# EasyEDA Pro project 21届智能车+蚂蚁搬家+主驱一体PCB文件.epro, schematic Schematic1

## Sheets
1 电源: Board Name: V1.0（20251113）; Create Date: 2025-11-10; Page Name: 电源; Project Name: NXP_micropython主板20251110; Schematic Name: Schematic1; Update Date: 2025-11-19; BladeWidth: 10; Company: 嘉立创EDA; Page Size: A4; RegionStart: 1; ShowBorder: 1; TitleBlock: 1; TitleBlockPosition: 3; Version: V1.0; XRegionCount: 6; YRegionCount: 4
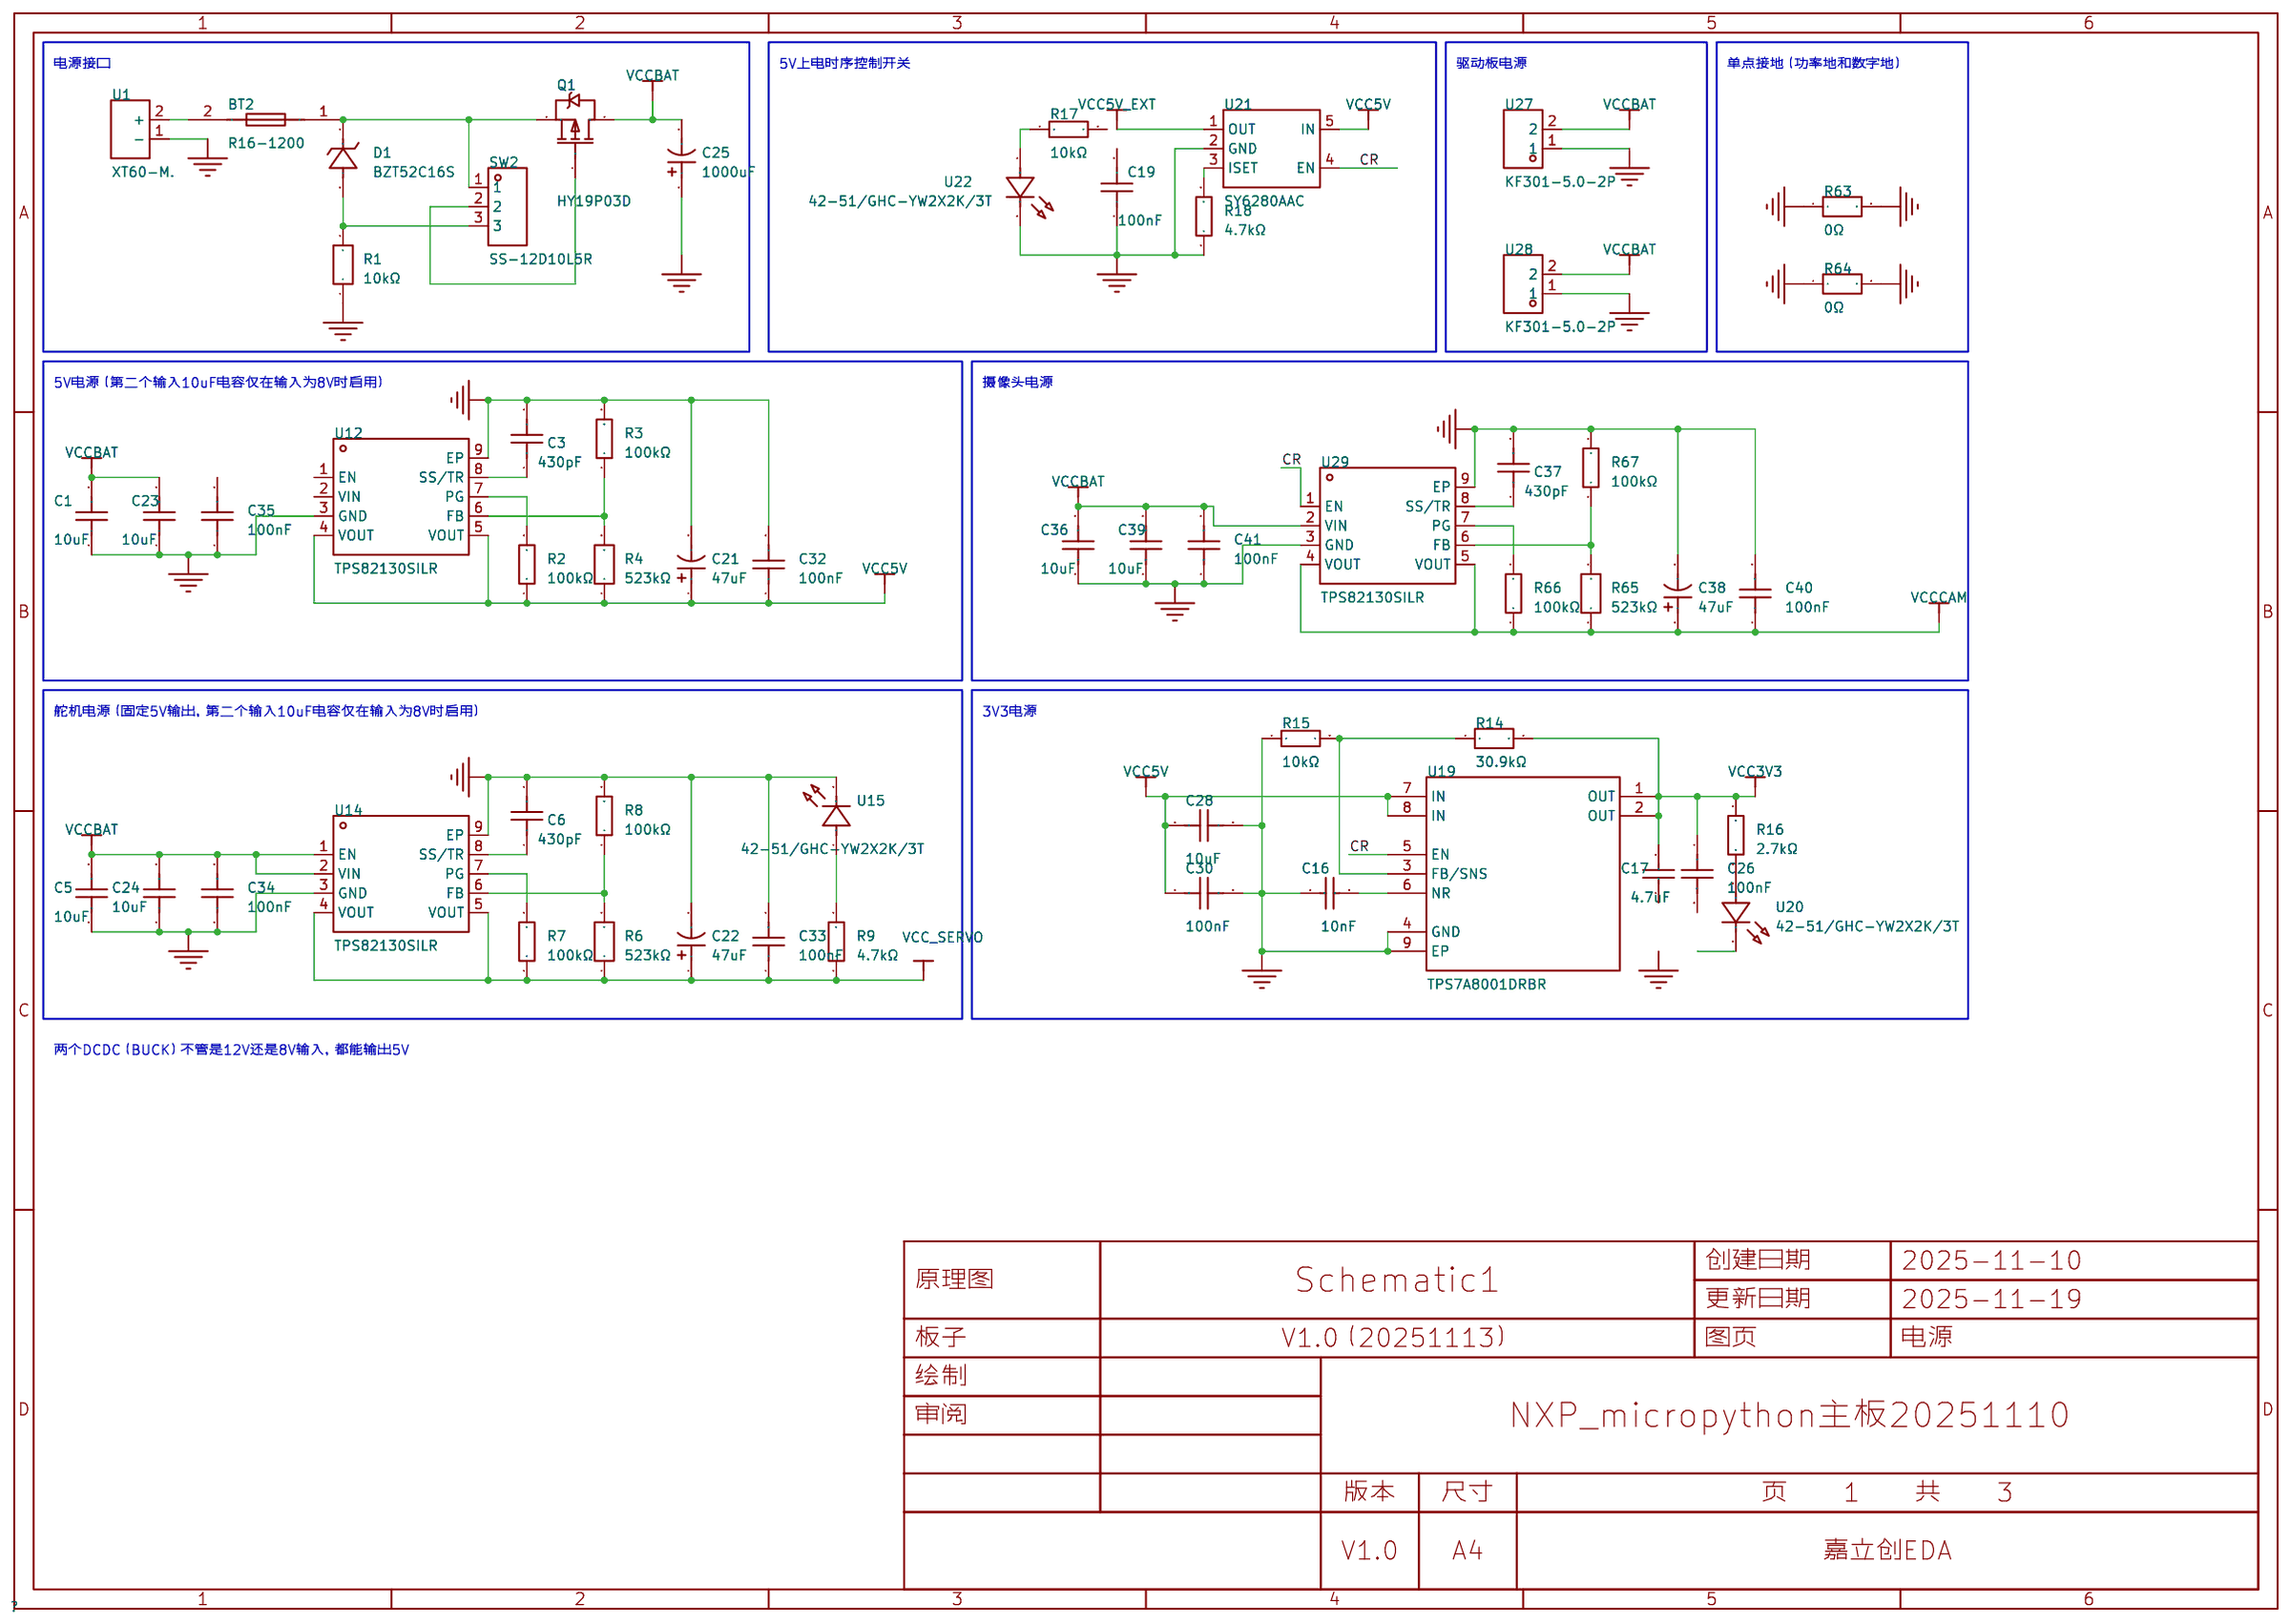
[diagram p0: 电源]
2 外设: Board Name: 20251113; Page Name: 外设; Update Date: 2025-11-15
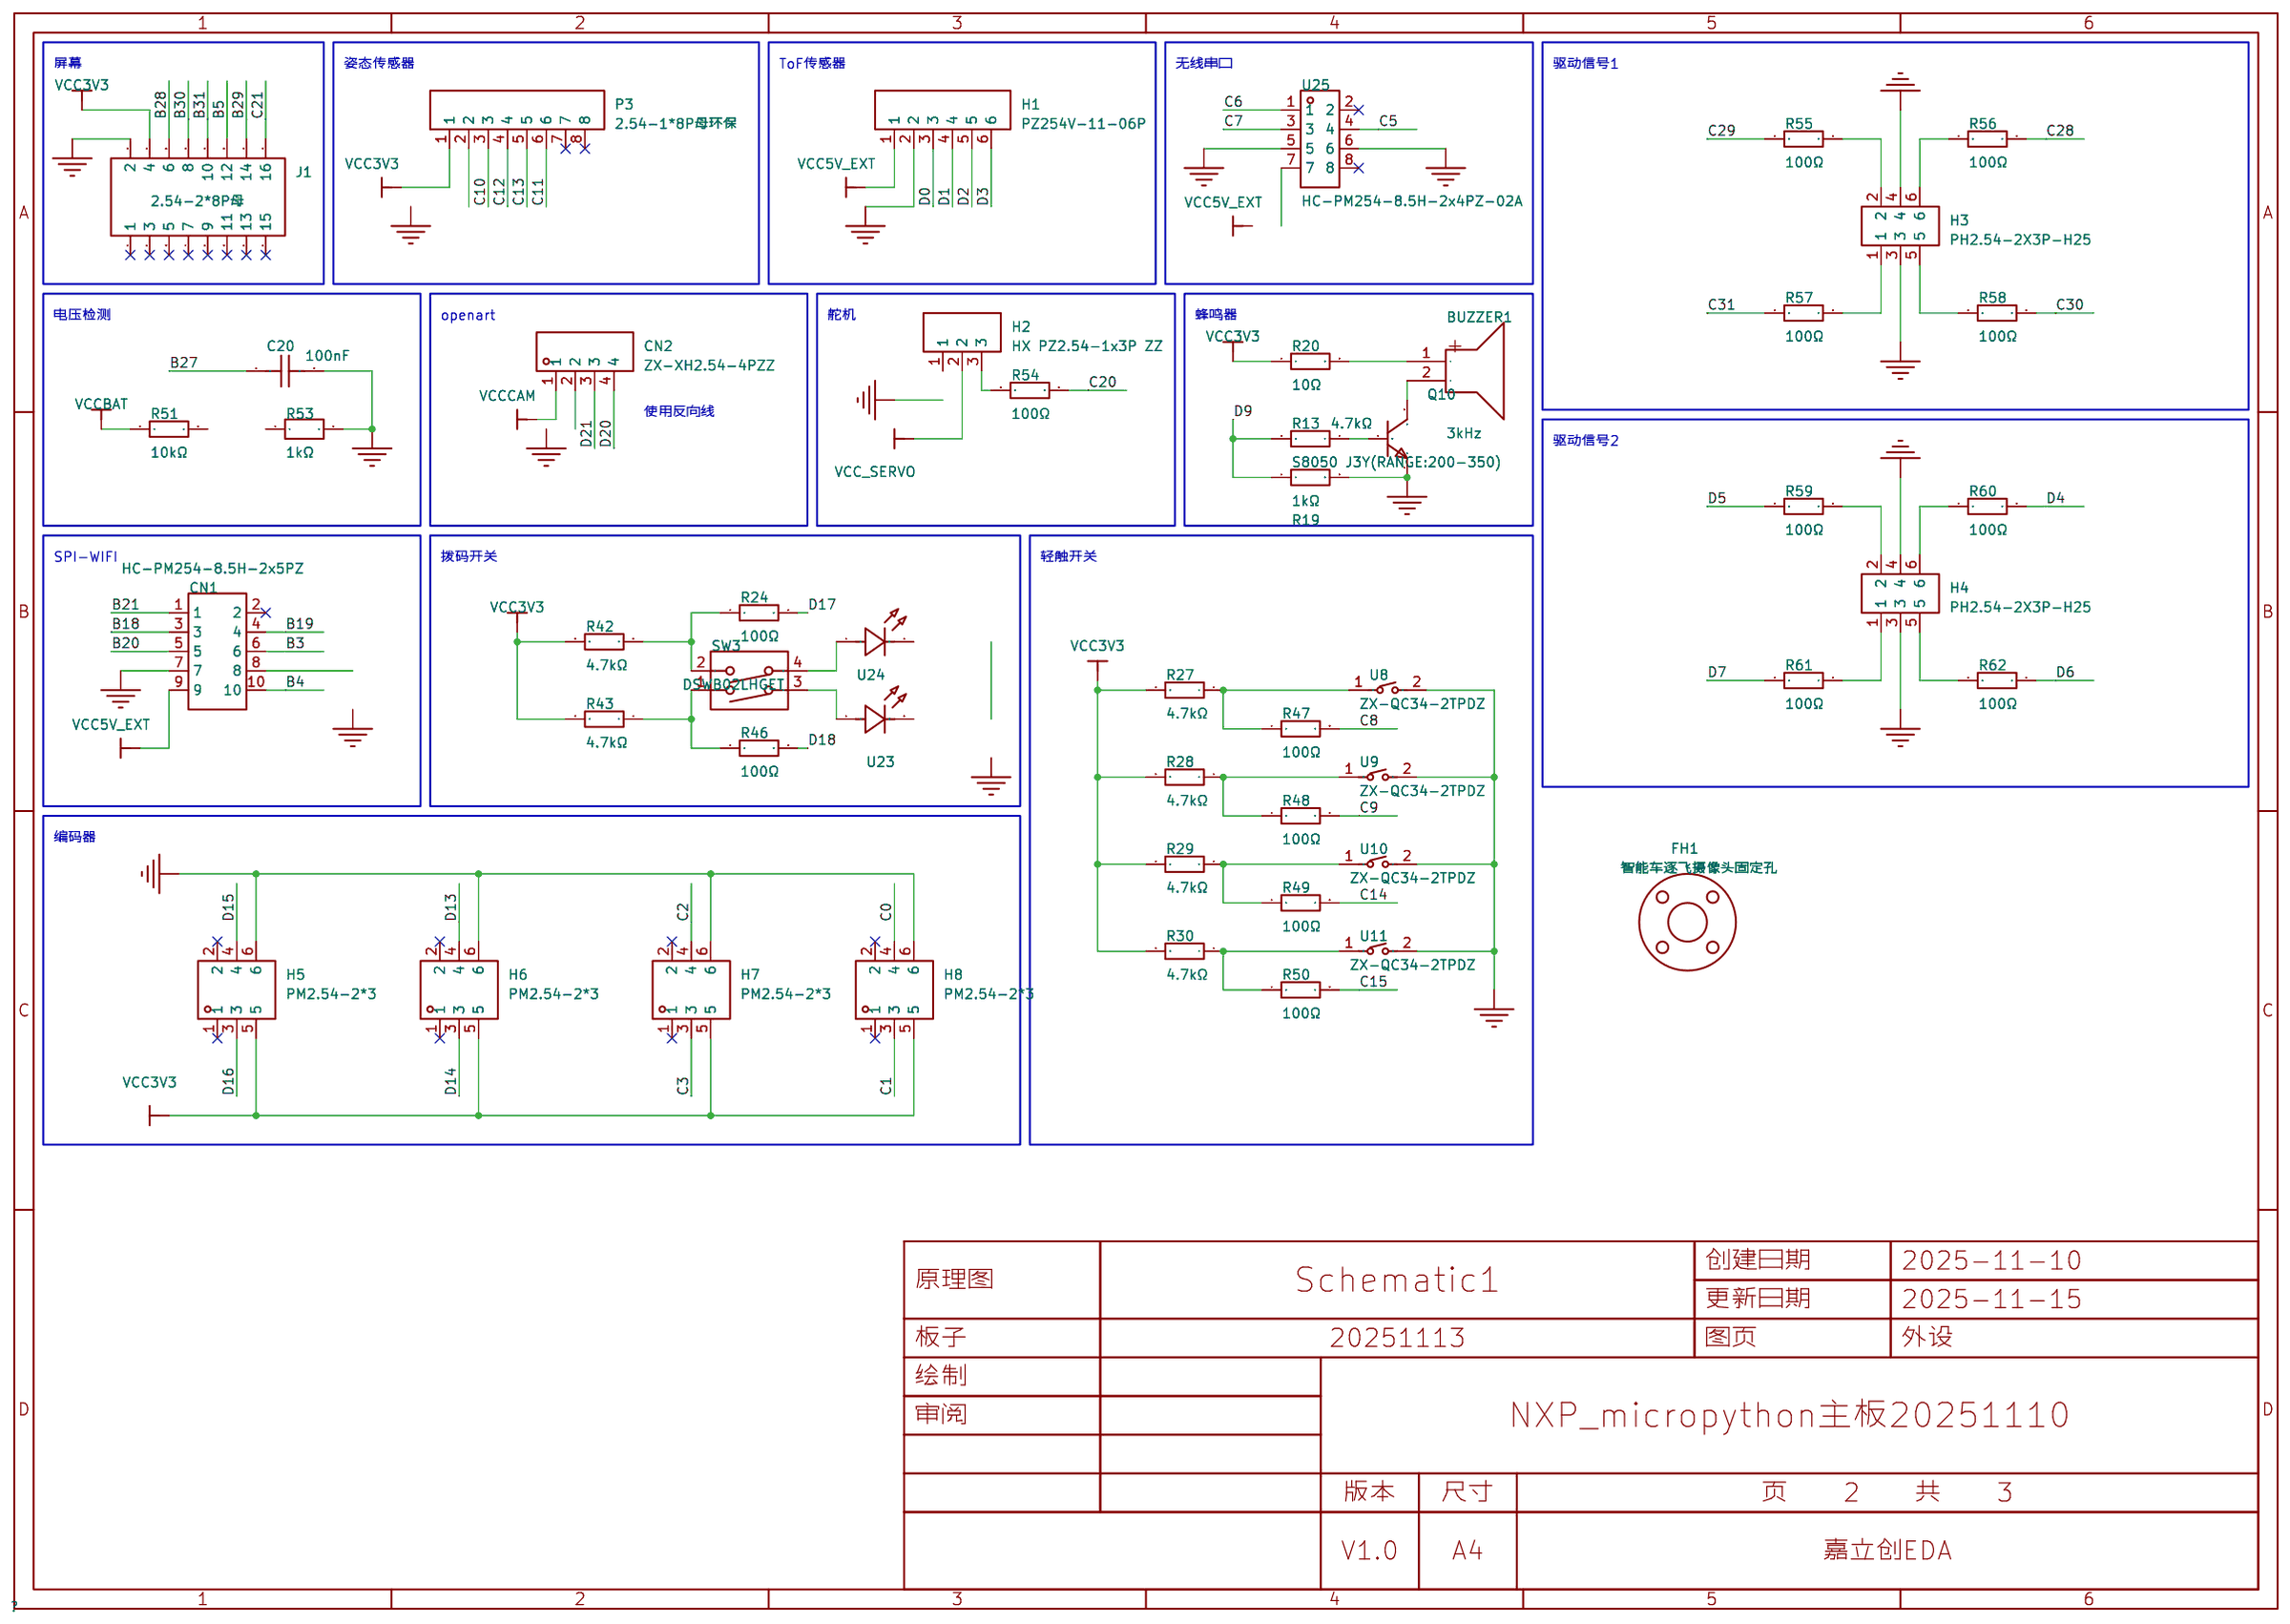
[diagram p1: 外设]
3 核心板: Board Name: 20251113; Page Name: 核心板; Update Date: 2025-11-15
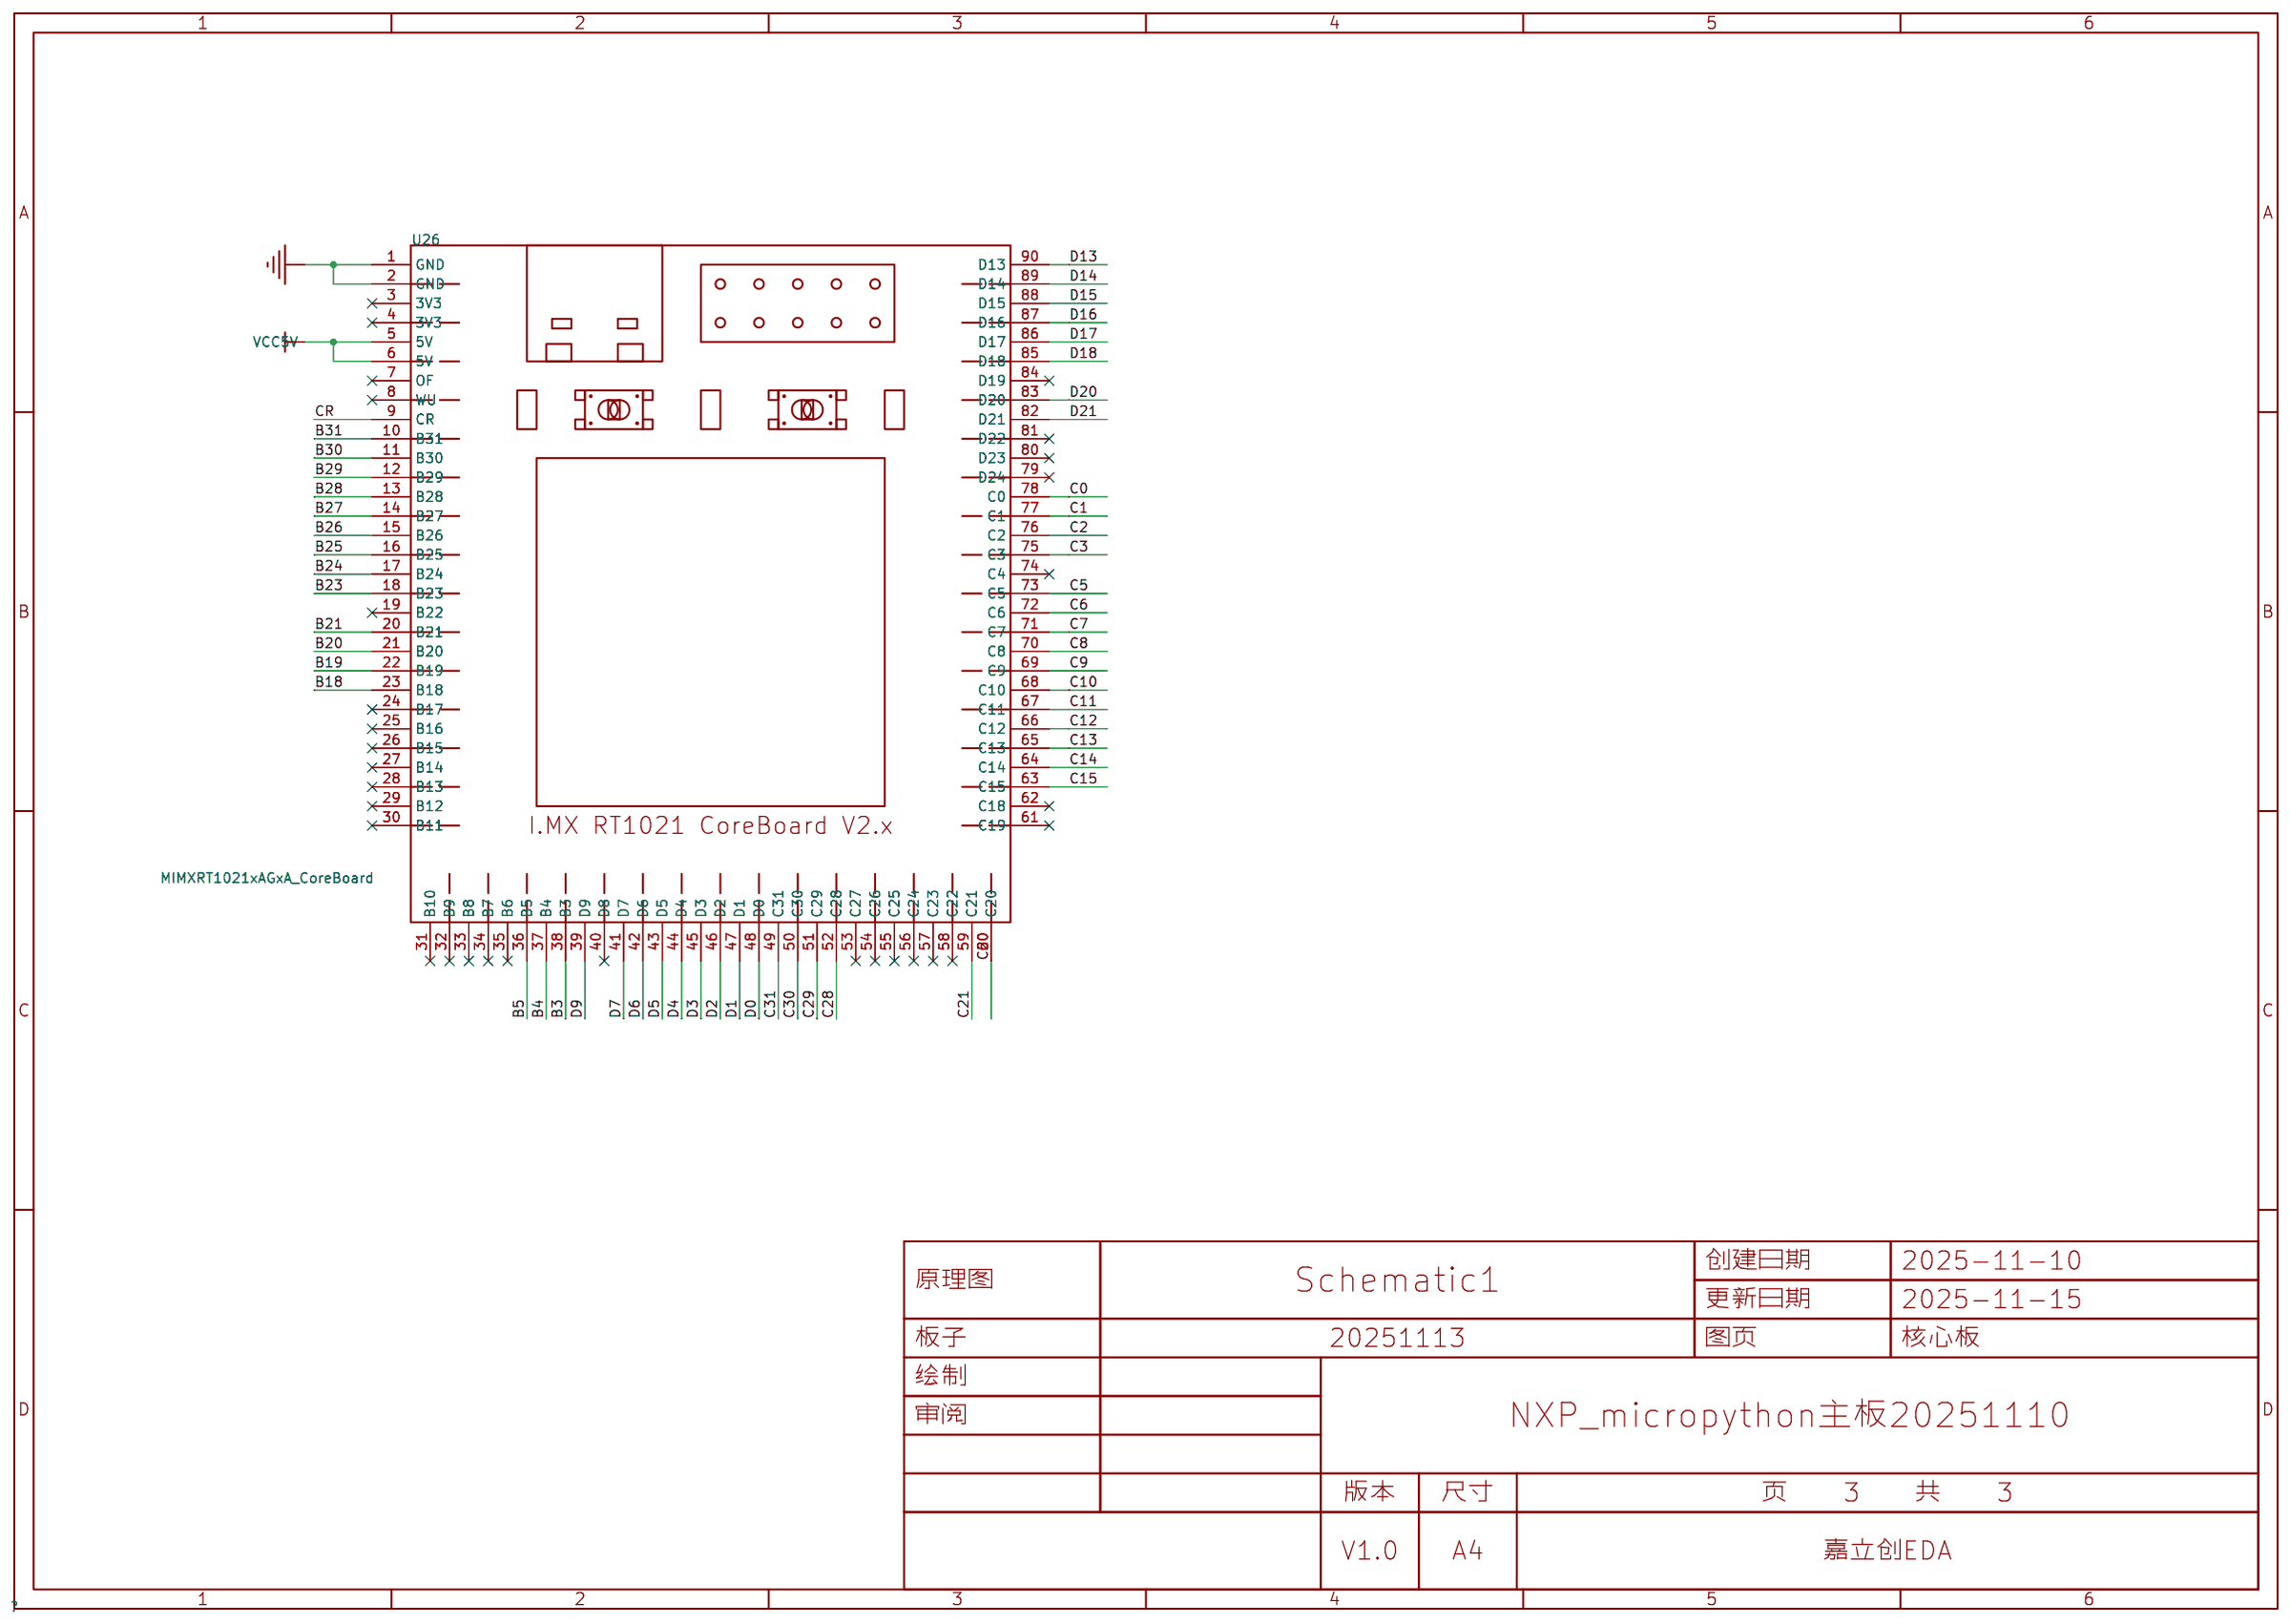
[diagram p2: 核心板]

## Parts
sheet 外设
BUZZER1  3kHz  [BUZ-TH_BD9.0-P5.00-D0.6-FD]
C20  100nF  [C0603]
CN1  HC-PM254-8.5H-2x5PZ  [HDR-TH_10P-P2.54-V-F-R2-C5-S2.54-1]
CN2  ZX-XH2.54-4PZZ  [CONN-TH_4P-P2.50_4PIN]
FH1  智能车逐飞摄像头固定孔  [智能车逐飞摄像头支架固定孔]
H1  PZ254V-11-06P  [HDR-TH_6P-P2.54-V-M]
H2  HX PZ2.54-1x3P ZZ  [CONN-TH_HX-PZ2.54-1X3P-ZZ]
H3  PH2.54-2X3P-H25  [HDR-TH_6P-P2.54-V-M-R2-C3-S2.54-1]
H4  PH2.54-2X3P-H25  [HDR-TH_6P-P2.54-V-M-R2-C3-S2.54-1]
H5  PM2.54-2*3  [HDR-TH_6P-P2.54-V-F-R2-C3-S2.54]
H6  PM2.54-2*3  [HDR-TH_6P-P2.54-V-F-R2-C3-S2.54]
H7  PM2.54-2*3  [HDR-TH_6P-P2.54-V-F-R2-C3-S2.54]
H8  PM2.54-2*3  [HDR-TH_6P-P2.54-V-F-R2-C3-S2.54]
J1  2.54-2*8P母  [HDR-TH_16P-P2.54-V-F-R2-C8-S2.54]
P3  2.54-1*8P母环保  [HDR-TH_8P-P2.54-V-F_2]
Q10  S8050 J3Y(RANGE:200-350)  [SOT-23-3_L3.0-W1.7-P0.95-LS2.9-BR]
R13  4.7kΩ  [R0603]
R19  1kΩ  [R0603]
R20  10Ω  [R0603]
R24  100Ω  [R0603]
R27  4.7kΩ  [R0603]
R28  4.7kΩ  [R0603]
R29  4.7kΩ  [R0603]
R30  4.7kΩ  [R0603]
R42  4.7kΩ  [R0603]
R43  4.7kΩ  [R0603]
R46  100Ω  [R0603]
R47  100Ω  [R0603]
R48  100Ω  [R0603]
R49  100Ω  [R0603]
R50  100Ω  [R0603]
R51  10kΩ  [R0603]
R53  1kΩ  [R0603]
R54  100Ω  [R0603]
R55  100Ω  [R0603]
R56  100Ω  [R0603]
R57  100Ω  [R0603]
R58  100Ω  [R0603]
R59  100Ω  [R0603]
R60  100Ω  [R0603]
R61  100Ω  [R0603]
R62  100Ω  [R0603]
SW3  DSWB02LHGET  [SW-TH_DSWB02LHGET]
U8  ZX-QC34-2TPDZ  [KEY-SMD_L3.9-W3.0-LS5.0-EH]
U9  ZX-QC34-2TPDZ  [KEY-SMD_L3.9-W3.0-LS5.0-EH]
U10  ZX-QC34-2TPDZ  [KEY-SMD_L3.9-W3.0-LS5.0-EH]
U11  ZX-QC34-2TPDZ  [KEY-SMD_L3.9-W3.0-LS5.0-EH]
U23  42-51/GHC-YW2X2K/3T  [LED-SMD_L1.6-W0.8-FD_GREEN-1]
U24  42-51/GHC-YW2X2K/3T  [LED-SMD_L1.6-W0.8-FD_GREEN-1]
U25  HC-PM254-8.5H-2x4PZ-02A  [HDR-TH_8P-P2.54-V-F-R2-C4-S2.54]
sheet 核心板
U26  MIMXRT1021xAGxA_CoreBoard  [MIMXRT1021xAGxA_CoreBoard_V2.x]
sheet 电源
BT2  R16-1200  [FUSE-TH_L18.5-W3.5-P10.20-D0.8]
C1  10uF  [C0805]
C3  430pF  [C0603]
C5  10uF  [C0805]
C6  430pF  [C0603]
C16  10nF  [C0805]
C17  4.7uF  [C0805]
C19  100nF  [C0603]
C21  47uF  [CAP-SMD_BD5.0-L5.3-W5.3-LS5.9-FD]
C22  47uF  [CAP-SMD_BD5.0-L5.3-W5.3-LS5.9-FD]
C23  10uF  [C0805]
C24  10uF  [C0805]
C25  1000uF  [CAP-TH_BD10.0-P5.00-D0.6-FD]
C26  100nF  [C0603]
C28  10uF  [C0805]
C30  100nF  [C0603]
C32  100nF  [C0603]
C33  100nF  [C0603]
C34  100nF  [C0603]
C35  100nF  [C0603]
C36  10uF  [C0805]
C37  430pF  [C0603]
C38  47uF  [CAP-SMD_BD5.0-L5.3-W5.3-LS5.9-FD]
C39  10uF  [C0805]
C40  100nF  [C0603]
C41  100nF  [C0603]
D1  BZT52C16S  [SOD-323_L1.7-W1.3-LS2.6-RD]
Q1  HY19P03D  [TO-252-2_L6.6-W6.1-P4.57-LS9.9-TL-CW]
R1  10kΩ  [R0603]
R2  100kΩ  [R0603]
R3  100kΩ  [R0603]
R4  523kΩ  [R0603]
R6  523kΩ  [R0603]
R7  100kΩ  [R0603]
R8  100kΩ  [R0603]
R9  4.7kΩ  [R0603]
R14  30.9kΩ  [R0603]
R15  10kΩ  [R0603]
R16  2.7kΩ  [R0603]
R17  10kΩ  [R0603]
R18  4.7kΩ  [R0603]
R63  0Ω  [R0603]
R64  0Ω  [R0603]
R65  523kΩ  [R0603]
R66  100kΩ  [R0603]
R67  100kΩ  [R0603]
SW2  SS-12D10L5R  [SW-TH_SS-12D10L9]
U1  XT60-M.  [CONN-TH_XT60]
U12  TPS82130SILR  [USIP-8_L3.0-W2.8-P0.65-TL-EP]
U14  TPS82130SILR  [USIP-8_L3.0-W2.8-P0.65-TL-EP]
U15  42-51/GHC-YW2X2K/3T  [LED-SMD_L1.6-W0.8-FD_GREEN-1]
U19  TPS7A8001DRBR  [VSON-8_L3.0-W3.0-P0.65-TL-EP]
U20  42-51/GHC-YW2X2K/3T  [LED-SMD_L1.6-W0.8-FD_GREEN-1]
U21  SY6280AAC  [SOT-23-5_L3.0-W1.7-P0.95-LS2.8-BR]
U22  42-51/GHC-YW2X2K/3T  [LED-SMD_L1.6-W0.8-FD_GREEN-1]
U27  KF301-5.0-2P  [CONN-TH_P5.00_KF301-5.0-2P]
U28  KF301-5.0-2P  [CONN-TH_P5.00_KF301-5.0-2P]
U29  TPS82130SILR  [USIP-8_L3.0-W2.8-P0.65-TL-EP]

## Library data of the parts
BUZZER1 = HNB09A03: 驱动方式:有源(内含驱动线路);构造类型:电磁式;频率:3kHz;声压(SPL):85dB;; LCSC Part Name: 电磁式有源一体蜂鸣器HNB09A03; Supplier Part: C96102; Manufacturer: 华能; Supplier Footprint: 插件,D=9mm; JLCPCB Part Class: 扩展库; Datasheet: https://atta.szlcsc.com/upload/public/pdf/source/20241128/61C4C8C3938BB25F7C38FBE94CCE8DCF.pdf; Supplier: LCSC; Driver Circuitry: 有源(内含驱动线路); Technology: 电磁式; Voltage - Supply: 1.5V~4.5V; Current Consumption: 30mA; Sound Pressure Level(SPL): 85dB; Diameter(φD): 9mm; Height: 5.5mm; Operating Temperature: -20℃~+70℃
C19 C20 C26 C30 C32-C35 C40 C41 = CL10B104KB8NNNC: 容值:100nF;精度:±10%;额定电压:50V;温度系数:X7R;; LCSC Part Name: 100nF ±10% 50V; Supplier Part: C1591; Manufacturer: SAMSUNG(三星); Supplier Footprint: 0603; JLCPCB Part Class: 扩展库; Datasheet: https://item.szlcsc.com/datasheet/CL10B104KB8NNNC/1943.html; Supplier: LCSC; Tolerance: ±10%; Voltage Rating: 50V; Temperature Coefficient: X7R
CN1 = HC-PM254-8.5H-2x5PZ: 插孔结构:2x5P;间距:2.54mm;行距:2.54mm;圆孔/方孔:方孔;安装方式:直插;排数:双排;总孔位数:10P;额定电流:3A;额定电压:-;插孔方向:顶部;塑高:8.5mm;触头材质:黄铜;触头镀层:金;工作温度:-40℃~+105℃;; LCSC Part Name: 间距2.54mm 2x5Pin 直插 PC3.0 H8.5; Supplier Part: C22373910; Manufacturer: HC(虹成电子); Supplier Footprint: 插件,P=2.54mm; JLCPCB Part Class: 扩展库; Datasheet: https://item.szlcsc.com/datasheet/HC-PM254-8.5H-2x5PZ/23870246.html; Supplier: LCSC; Holes Structure: 2x5P; Pitch: 2.54mm; Row Spacing: 2.54mm; Circular Hole / Square Hole: 方孔; Mounting Type: 直插; Number of Rows: 双排; Number of Positions: 10P; Current Rating: 3A; Holes Direction: 顶部; Insulation Height: 8.5mm; Contact Material: 黄铜; Contact Plating: 金; Operating Temperature: -40℃~+105℃; PIN Length: 3mm
CN2 = ZX-XH2.54-4PZZ: 插针结构:1x4P;间距:2.5mm;安装方式:直插;参考系列:XH;总PIN数:4P;排数:1;每排PIN数:4;行距:-;额定电流:3A;触头材质:黄铜;触头镀层:锡;工作温度:-25℃~+85℃;; LCSC Part Name: 1x4P 间距:2.5mm 直插 系列:XH; Supplier Part: C7429634; Manufacturer: Megastar(兆星); Supplier Footprint: 插件,P=2.5mm; JLCPCB Part Class: 扩展库; Datasheet: https://item.szlcsc.com/datasheet/ZX-XH2.54-4PZZ/8427551.html; Supplier: LCSC; Pins Structure: 1x4P; Pitch: 2.5mm; Mounting Type: 直插; Reference Series: XH; Number of Pins: 4P; Number of Rows: 1; Number of PINs Per Row: 4; Current Rating: 3A; Contact Material: 黄铜; Contact Plating: 锡; Operating Temperature: -25℃~+85℃; Voltage Rating: 250V; Plastic Material: PA66; Flame Retardant Rating: UL94V-0; Color: 白色; Z-Height of the Board: 7mm; X-Length of Bottom Edge on Board (Spacing Line): 12.5mm; Y-Width of Bottom Edge on Board: 5.9mm
FH1 = 智能车逐飞摄像头固定孔: 3DModel: 逐飞摄像头法兰盘-Body
H1 = PZ254V-11-06P: 插针结构:1x6P;间距:2.54mm;行距:-;圆针/方针:方针;安装方式:直插;排数:单排;总PIN位数:6P;额定电流:-;额定电压:-;配合针长度:6mm;塑高:2.5mm;端接针长度:3mm;触头材质:黄铜;触头镀层:-;工作温度:-40℃~+105℃;颜色:黑色;; LCSC Part Name: 1x6P 间距:2.54mm 方针 直插; Supplier Part: C492405; Manufacturer: XFCN(兴飞); Supplier Footprint: 插件,P=2.54mm; JLCPCB Part Class: 扩展库; Datasheet: https://atta.szlcsc.com/upload/public/pdf/source/20200309/C492405_597F1930F5B55CC3C7FD95458F1C3977.pdf; Supplier: LCSC; Pin Structure: 1x6P; Pitch: 2.54mm; Circluar Pins/Square Pins: 方针; Mounting Type: 直插; Number of Rows: 单排; Number of Pins: 6P; Length of Mating Pin: 6mm; Insulation Height: 2.5mm; Length of End Connection Pin: 3mm; Contact Material: 黄铜; Operating Temperature: -40℃~+105℃; Color: 黑色
H2 = HX PZ2.54-1x3P ZZ: 插针结构:1x3P;间距:2.54mm;行距:-;圆针/方针:方针;安装方式:直插;排数:单排;总PIN位数:3P;额定电流:3A;额定电压:1kV;配合针长度:6mm;塑高:2.5mm;端接针长度:3mm;触头材质:黄铜;触头镀层:金;工作温度:-40℃~+105℃;颜色:黑色;; LCSC Part Name: 1x3P 间距:2.54mm 方针 直插; Supplier Part: C32713269; Manufacturer: hanxia(韩下); Supplier Footprint: 插件,P=2.54mm; JLCPCB Part Class: 扩展库; Datasheet: https://item.szlcsc.com/datasheet/HX%2520PZ2.54-1x3P%2520ZZ/34444549.html; Supplier: LCSC; Pin Structure: 1x3P; Pitch: 2.54mm; Circluar Pins/Square Pins: 方针; Mounting Type: 直插; Number of Rows: 单排; Number of Pins: 3P; Current Rating: 3A; Voltage Rating (Max): 1kV; Length of Mating Pin: 6mm; Insulation Height: 2.5mm; Length of End Connection Pin: 3mm; Contact Material: 黄铜; Contact Plating: 金; Operating Temperature: -40℃~+105℃; Color: 黑色
H3 H4 = PH2.54-2X3P-H25: 插针结构:2x3P;间距:2.54mm;行距:2.54mm;圆针/方针:方针;安装方式:直插;排数:双排;总PIN位数:6P;额定电流:3A;额定电压:-;配合针长度:6mm;塑高:2.5mm;端接针长度:3mm;触头材质:黄铜;触头镀层:金;工作温度:-40℃~+105℃;颜色:黑色;; LCSC Part Name: 2x3P 间距:2.54mm 方针 直插; Supplier Part: C42431837; Manufacturer: JXTCONN(聚兴泰); Supplier Footprint: 插件,P=2.54mm; JLCPCB Part Class: 扩展库; Datasheet: https://item.szlcsc.com/datasheet/PH2.54-2X3P-H25/44458967.html; Supplier: LCSC; Pin Structure: 2x3P; Pitch: 2.54mm; Row Spacing: 2.54mm; Circluar Pins/Square Pins: 方针; Mounting Type: 直插; Number of Rows: 双排; Number of Pins: 6P; Current Rating: 3A; Length of Mating Pin: 6mm; Insulation Height: 2.5mm; Length of End Connection Pin: 3mm; Contact Material: 黄铜; Contact Plating: 金; Operating Temperature: -40℃~+105℃; Color: 黑色
H5-H8 = PM2.54-2*3: 插孔结构:2x3P;间距:2.54mm;行距:2.54mm;圆孔/方孔:方孔;安装方式:直插;排数:双排;总孔位数:6P;额定电流:2.5A;插孔方向:顶部;塑高:8.5mm;工作温度:-40℃~+105℃;; LCSC Part Name: 间距:2.54mm 2x3P 直插; Supplier Part: C5116527; Manufacturer: ZHOURI(洲日); Supplier Footprint: 插件,P=2.54mm; JLCPCB Part Class: 扩展库; Datasheet: https://item.szlcsc.com/datasheet/PM2.54-2*3/5692944.html; Supplier: LCSC; Holes Structure: 2x3P; Pitch: 2.54mm; Row Spacing: 2.54mm; Circular Hole / Square Hole: 方孔; Mounting Type: 直插; Number of Rows: 双排; Number of Positions: 6P; Current Rating: 2.5A; Holes Direction: 顶部; Insulation Height: 8.5mm; Operating Temperature: -40℃~+105℃
J1 = 2.54-2*8P母: 插孔结构:2x8P;间距:2.54mm;行距:2.54mm;圆孔/方孔:方孔;安装方式:直插;排数:双排;总孔位数:16P;插孔方向:顶部;塑高:-;触头材质:黄铜;触头镀层:-;; LCSC Part Name: 2x8P 间距:2.54mm 直插; Supplier Part: C30734; Manufacturer: BOOMELE(博穆精密); Supplier Footprint: 插件,P=2.54mm; JLCPCB Part Class: 扩展库; Datasheet: https://item.szlcsc.com/datasheet/2.54-2*8P%25E6%25AF%258D/31491.html; Supplier: LCSC; Holes Structure: 2x8P; Pitch: 2.54mm; Row Spacing: 2.54mm; Circular Hole / Square Hole: 方孔; Mounting Type: 直插; Number of Rows: 双排; Number of Positions: 16P; Holes Direction: 顶部; Contact Material: 黄铜
P3 = 2.54-1*8P母环保: 插孔结构:1x8P;间距:2.54mm;行距:-;圆孔/方孔:方孔;安装方式:直插;排数:单排;总孔位数:8P;插孔方向:顶部;塑高:-;触头材质:-;触头镀层:-;; LCSC Part Name: 1x8P 间距:2.54mm 直插; Supplier Part: C27438; Manufacturer: BOOMELE(博穆精密); Supplier Footprint: 插件,P=2.54mm; JLCPCB Part Class: 扩展库; Datasheet: https://item.szlcsc.com/datasheet/2.54-1*8P%25E6%25AF%258D%25E7%258E%25AF%25E4%25BF%259D/28187.html; Supplier: LCSC; Holes Structure: 1x8P; Pitch: 2.54mm; Circular Hole / Square Hole: 方孔; Mounting Type: 直插; Number of Rows: 单排; Number of Positions: 8P; Holes Direction: 顶部
Q10 = S8050 J3Y(RANGE:200-350): 晶体管类型:NPN;集电极电流(Ic):500mA;集射极击穿电压(Vceo):25V;功率(Pd):300mW;直流电流增益(hFE@Ic,Vce):200@500mA,1V;; LCSC Part Name: NPN 电流:500mA 耐压:25V H档(200-350); Supplier Part: C2146; Manufacturer: CJ(江苏长电/长晶); Supplier Footprint: SOT-23; JLCPCB Part Class: 基础库; Datasheet: https://atta.szlcsc.com/upload/public/pdf/source/20231013/FF37B6A000E6CDA75C9C999D2E78731F.pdf; Supplier: LCSC; Transistor Type: NPN; Collector Current (Ic): 500mA; Collector-Emitter Breakdown Voltage (Vceo): 25V; Power Dissipation (Pd): 300mW; DC Current Gain (hFE@Ic,Vce): 200@500mA,1V; Transition Frequency (fT): 150MHz; Collector Cut-Off Current (Icbo): 100nA; Collector-Emitter Saturation Voltage (VCE(sat)@Ic,Ib): 600mV@500mA,50mA; Operating Temperature: -55℃~+150℃
R9 R13 R18 R27-R30 R42 R43 = 0603WAF4701T5E: 电阻类型:厚膜电阻;阻值:4.7kΩ;精度:±1%;功率:100mW;最大工作电压:75V;温度系数:±100ppm/℃;; LCSC Part Name: 4.7kΩ ±1% 100mW 厚膜电阻; Supplier Part: C23162; Manufacturer: UNI-ROYAL(厚声); Supplier Footprint: 0603; JLCPCB Part Class: 基础库; Datasheet: https://atta.szlcsc.com/upload/public/pdf/source/20200306/C422600_1E6D84923E4A46A82E41ADD87F860B5C.pdf; Supplier: LCSC; Type: 厚膜电阻; Tolerance: ±1%; Power(Watts): 100mW; Overload Voltage (Max): 75V; Temperature Coefficient: ±100ppm/℃; Operating Temperature Range: -55℃~+155℃
R19 = RT0603BRD071KL: 电阻类型:薄膜电阻;阻值:1kΩ;精度:±0.1%;功率:100mW;最大工作电压:75V;温度系数:±25ppm/℃;; LCSC Part Name: 薄膜电阻 1kΩ ±0.1% 100mW; Supplier Part: C110776; Manufacturer: YAGEO(国巨); Supplier Footprint: 0603; JLCPCB Part Class: 扩展库; Datasheet: https://atta.szlcsc.com/upload/public/pdf/source/20170704/1499151282044.pdf; Supplier: LCSC; Type: 薄膜电阻; Tolerance: ±0.1%; Power(Watts): 100mW; Overload Voltage (Max): 75V; Temperature Coefficient: ±25ppm/℃; Operating Temperature Range: -55℃~+155℃
R20 = 0603WAF100JT5E: 电阻类型:厚膜电阻;阻值:10Ω;精度:±1%;功率:100mW;最大工作电压:75V;温度系数:±400ppm/℃;; LCSC Part Name: 10Ω ±1% 100mW 厚膜电阻; Supplier Part: C22859; Manufacturer: UNI-ROYAL(厚声); Supplier Footprint: 0603; JLCPCB Part Class: 基础库; Datasheet: https://atta.szlcsc.com/upload/public/pdf/source/20200306/C422600_1E6D84923E4A46A82E41ADD87F860B5C.pdf; Supplier: LCSC; Type: 厚膜电阻; Tolerance: ±1%; Power(Watts): 100mW; Overload Voltage (Max): 75V; Temperature Coefficient: ±400ppm/℃; Operating Temperature Range: -55℃~+155℃
R24 R46-R50 R54-R62 = 0603WAF1000T5E: 电阻类型:厚膜电阻;阻值:100Ω;精度:±1%;功率:100mW;最大工作电压:75V;温度系数:±200ppm/℃;; LCSC Part Name: 100Ω ±1% 100mW 厚膜电阻; Supplier Part: C22775; Manufacturer: UNI-ROYAL(厚声); Supplier Footprint: 0603; JLCPCB Part Class: 基础库; Datasheet: https://atta.szlcsc.com/upload/public/pdf/source/20200306/C422600_1E6D84923E4A46A82E41ADD87F860B5C.pdf; Supplier: LCSC; Type: 厚膜电阻; Tolerance: ±1%; Power(Watts): 100mW; Overload Voltage (Max): 75V; Temperature Coefficient: ±200ppm/℃; Operating Temperature Range: -55℃~+155℃
R15 R17 R51 = 0603WAF1002T5E: 电阻类型:厚膜电阻;阻值:10kΩ;精度:±1%;功率:100mW;最大工作电压:75V;温度系数:±100ppm/℃;; LCSC Part Name: 厚膜电阻 10kΩ ±1% 100mW; Supplier Part: C25804; Manufacturer: UNI-ROYAL(厚声); Supplier Footprint: 0603; JLCPCB Part Class: 基础库; Datasheet: https://atta.szlcsc.com/upload/public/pdf/source/20200306/C422600_1E6D84923E4A46A82E41ADD87F860B5C.pdf; Supplier: LCSC; Type: 厚膜电阻; Tolerance: ±1%; Power(Watts): 100mW; Overload Voltage (Max): 75V; Temperature Coefficient: ±100ppm/℃; Operating Temperature Range: -55℃~+155℃
R53 = FRC0603F1001TS: 电阻类型:厚膜电阻;阻值:1kΩ;精度:±1%;功率:100mW;工作电压:75V;温度系数:±100ppm/℃;; LCSC Part Name: 1kΩ ±1% 100mW 厚膜电阻; Supplier Part: C2907002; Manufacturer: FOJAN(富捷); Supplier Footprint: 0603; JLCPCB Part Class: 扩展库; Supplier: LCSC; Type: 厚膜电阻; Tolerance: ±1%; Power(Watts): 100mW; Voltage-Supply(Max): 75V; Temperature Coefficient: ±100ppm/℃; Operating Temperature: -55℃~+155℃
SW3 = DSWB02LHGET: 类型:平拨,凸起式;电路结构:单刀单掷;开关位数:2位;使用寿命:-;颜色:红色;; LCSC Part Name: 拨码开关,平拨开关,DSWB02LHGET; Supplier Part: C99421; Manufacturer: YE; Supplier Footprint: 插件; JLCPCB Part Class: 扩展库; Datasheet: https://atta.szlcsc.com/upload/public/pdf/source/20230906/EFD9230F686161BBBCD1B62855702D44.pdf; Supplier: LCSC; Type: 平拨,凸起式; Circuit: 单刀单掷; Number of Positions: 2位; Lead Pitch: 2.54mm; Color: 红色
U8-U11 = ZX-QC34-2TPDZ: 电路结构:单刀单掷;按钮形状:圆形按钮;作用力:2.6N;安装方式:立贴;开关长度:3mm;开关宽度:4mm;开关高度:2mm;带支架:不带支架;触点电流:50mA;额定电压:12V;机械寿命:10万次;; LCSC Part Name: 3*4*2贴片开关带柱; Supplier Part: C7470219; Manufacturer: Megastar(兆星); Supplier Footprint: SMD; JLCPCB Part Class: 扩展库; Datasheet: https://atta.szlcsc.com/upload/public/pdf/source/20230724/D2731FAADF93973E25928DE23F241F8A.pdf; Supplier: LCSC; Circuit: 单刀单掷; Actuator Style: 圆形按钮; Operating Force: 2.6N; Mounting Style: 立贴; Switch Length: 3mm; Switch Width: 4mm; Switch Height: 2mm; Strike Gundam: 不带支架; Contact Current: 50mA; Voltage Rating: 12V; Actuator/Cap Color: 黑色; Pin Style: 鸥翼型; Mechanical Life: 10万次; Operating Temperature: -30℃~+80℃
U15 U20 U22-U24 = 42-51/GHC-YW2X2K/3T: 发光颜色:翠绿色;正向电流:-;主波长:520nm~535nm;发光强度:2850mcd;; LCSC Part Name: 正发光贴片灯 颜色正绿色 发光二极管; Supplier Part: C5136797; Manufacturer: EVERLIGHT(亿光); Supplier Footprint: 0603; JLCPCB Part Class: 扩展库; Datasheet: https://atta.szlcsc.com/upload/public/pdf/source/20220916/FBE88CF67A3FC292A254CF6ACE30EBDE.pdf; Supplier: LCSC; Emitted Color: 翠绿色; Dominant Wavelength: 520nm~535nm; Luminous Intensity: 2850mcd
U25 = HC-PM254-8.5H-2x4PZ-02A: 插孔结构:2x4P;间距:2.54mm;行距:2.54mm;圆孔/方孔:方孔;安装方式:直插;排数:双排;总孔位数:8P;额定电流:3A;额定电压:-;插孔方向:顶部;塑高:8.5mm;触头材质:黄铜;触头镀层:金;工作温度:-40℃~+105℃;; LCSC Part Name: 间距2.54mm 2x4Pin 直插 PC3.0 H8.5; Supplier Part: C22373909; Manufacturer: HC(虹成电子); Supplier Footprint: 插件,P=2.54mm; JLCPCB Part Class: 扩展库; Datasheet: https://item.szlcsc.com/datasheet/HC-PM254-8.5H-2x4PZ-02A/23870245.html; Supplier: LCSC; Holes Structure: 2x4P; Pitch: 2.54mm; Row Spacing: 2.54mm; Circular Hole / Square Hole: 方孔; Mounting Type: 直插; Number of Rows: 双排; Number of Positions: 8P; Current Rating: 3A; Holes Direction: 顶部; Insulation Height: 8.5mm; Contact Material: 黄铜; Contact Plating: 金; Operating Temperature: -40℃~+105℃; PIN Length: 3mm
U26 = MIMXRT1021xAGxA_CoreBoard
BT2 = R16-1200: 耐压(Vmax):16V;最大电流(Imax):100A;保持电流(Ihold):12A;跳闸电流(Itrip):20.4A;; LCSC Part Name: 12A 16V; Supplier Part: C2833480; Manufacturer: 台湾陆海; Supplier Footprint: 插件,P=10.2mm; JLCPCB Part Class: 扩展库; Datasheet: https://item.szlcsc.com/datasheet/R16-1200/2994204.html; Supplier: LCSC; Voltage - Max: 16V; Current - Max: 100A; Hold Current: 12A; Trip Current: 20.4A; Power Dissipation: 4.2W; Resistance - Initial (Ri) (Min): 2.6mΩ; Resistance - Post Trip (R1) (Max): 9mΩ; Time to Trip(Max): 7.5s; Operating Temperature: -40℃~+85℃
C1 C5 C23 C24 C36 C39 = GRM21BR61H106KE43L: 容值:10uF;精度:±10%;额定电压:50V;材质(温度系数):X5R;; LCSC Part Name: 10uF ±10% 50V; Supplier Part: C440198; Manufacturer: muRata(村田); Supplier Footprint: 0805; JLCPCB Part Class: 基础库; Datasheet: https://atta.szlcsc.com/upload/public/pdf/source/20230811/95AAE0C9AF55EDC31B7A4D8B733F534E.pdf; Supplier: LCSC; Tolerance: ±10%; Voltage Rated: 50V; Temperature Coefficient: X5R
C3 C6 C37 = CC0603JRNPO9BN431: 容值:430pF;精度:±5%;额定电压:50V;材质(温度系数):NP0;; LCSC Part Name: 430pF ±5% 50V; Supplier Part: C309472; Manufacturer: YAGEO(国巨); Supplier Footprint: 0603; JLCPCB Part Class: 扩展库; Datasheet: https://atta.szlcsc.com/upload/public/pdf/source/20191125/C354976_4A9AE911FA5758D8C0A36AE6394FD4D7.pdf; Supplier: LCSC; Tolerance: ±5%; Voltage Rated: 50V; Temperature Coefficient: NP0
C16 = CL21B103KBANNNC: 容值:10nF;精度:±10%;额定电压:50V;材质(温度系数):X7R;; LCSC Part Name: 10nF ±10% 50V; Supplier Part: C1710; Manufacturer: SAMSUNG(三星); Supplier Footprint: 0805; JLCPCB Part Class: 基础库; Datasheet: https://atta.szlcsc.com/upload/public/pdf/source/20160218/1457707763339.pdf; Supplier: LCSC; Tolerance: ±10%; Voltage Rated: 50V; Temperature Coefficient: X7R
C17 = CL21A475KBQNNNE: 容值:4.7uF;精度:±10%;额定电压:50V;材质(温度系数):X5R;; LCSC Part Name: 4.7uF ±10% 50V; Supplier Part: C98192; Manufacturer: SAMSUNG(三星); Supplier Footprint: 0805; JLCPCB Part Class: 扩展库; Datasheet: https://atta.szlcsc.com/upload/public/pdf/source/20160218/1457707763339.pdf; Supplier: LCSC; Tolerance: ±10%; Voltage Rated: 50V; Temperature Coefficient: X5R
C21 C22 C38 = JVJ25V47M5x5: 容值:47uF;精度:±20%;额定电压:25V;纹波电流:35mA@120Hz;; LCSC Part Name: 47uF ±20% 25V; Supplier Part: C46550408; Manufacturer: JIERR(捷而瑞); Supplier Footprint: SMD,D5xL5.4mm; JLCPCB Part Class: 扩展库; Datasheet: https://item.szlcsc.com/datasheet/JVJ25V47M5x5/48680102.html; Supplier: LCSC; Tolerance: ±20%; Voltage Rating: 25V; Ripple Current: 35mA@120Hz; Diameter: 5mm; Height - Seated (Max): 5.4mm; Lifetime: 2000hrs@105℃; Operating Temperature: -55℃~+105℃
C25 = CD288108M1V1020VFL: 容值:1000uF;额定电压:35V;; LCSC Part Name: 1000uF 35V; Supplier Part: C7499950; Manufacturer: HRK(鸿瑞凯电子); Supplier Footprint: 插件,D10xL20mm; JLCPCB Part Class: 扩展库; Datasheet: https://item.szlcsc.com/datasheet/CD288108M1V1020VFL/8575810.html; Supplier: LCSC; Voltage Rating: 35V; Diameter: 10mm; Height - Seated (Max): 20mm; Operating Temperature: -40℃~+105℃
C28 = CGA0805X5R106K250MT: 容值:10uF;精度:±10%;额定电压:25V;温度系数:X5R;; LCSC Part Name: 10uF ±10% 25V; Supplier Part: C6119887; Manufacturer: HRE(芯声); Supplier Footprint: 0805; JLCPCB Part Class: 扩展库; Datasheet: https://item.szlcsc.com/datasheet/CGA0805X5R106K250MT/7062593.html; Supplier: LCSC; Tolerance: ±10%; Voltage Rating: 25V; Temperature Coefficient: X5R
D1 = BZT52C16S_C19077449: 二极管配置:独立式;稳压值(标称值):16V;稳压值(范围):15.3V~17.1V;耗散功率(Pd):200mW;; LCSC Part Name: 表面贴装齐纳二极管; Supplier Part: C19077449; Manufacturer: R+O(宏嘉诚); Supplier Footprint: SOD-323; JLCPCB Part Class: 扩展库; Datasheet: https://item.szlcsc.com/datasheet/BZT52C16S/20275534.html; Supplier: LCSC; Diode Configuration: 独立式; Zener Voltage(Nom): 16V; Reverse Leakage Current (Ir): 100nA; Zener Voltage(Range): 15.3V~17.1V; Pd - Power Dissipation: 200mW; Impedance(Zzt): 40Ω; Impedance(Zzk): 200Ω; Operating Junction Temperature Range: -55℃~+150℃
Q1 = HY19P03D: 类型:P沟道;漏源电压(Vdss):30V;连续漏极电流(Id):90A;功率(Pd):50W;导通电阻(RDS(on)@Vgs,Id):6mΩ@10V,45A;阈值电压(Vgs(th)@Id):3V@250uA;; LCSC Part Name: P沟道 耐压:30V 电流:90A; Supplier Part: C122492; Manufacturer: HUAYI(华羿微); Supplier Footprint: TO-252-2; Datasheet: https://atta.szlcsc.com/upload/public/pdf/source/20170728/C122492_1501225751911848809.pdf; Supplier: LCSC; Type: P沟道; Drain Source Voltage (Vdss): 30V; Continuous Drain Current (Id): 90A; Power Dissipation (Pd): 50W; Drain Source On Resistance (RDS(on)@Vgs,Id): 6mΩ@10V,45A; Gate Threshold Voltage (Vgs(th)@Id): 3V@250uA
R1 = FRC0603J103 TS: 电阻类型:厚膜电阻;阻值:10kΩ;精度:±5%;功率:100mW;工作电压:75V;温度系数:±100ppm/℃;; LCSC Part Name: 10kΩ ±5% 100mW 厚膜电阻; Supplier Part: C2930027; Manufacturer: FOJAN(富捷); Supplier Footprint: 0603; JLCPCB Part Class: 扩展库; Datasheet: https://item.szlcsc.com/datasheet/FRC0603J103%2520TS/3266960.html; Supplier: LCSC; Type: 厚膜电阻; Tolerance: ±5%; Power(Watts): 100mW; Voltage-Supply(Max): 75V; Temperature Coefficient: ±100ppm/℃; Operating Temperature: -55℃~+155℃
R2 R3 R7 R8 R66 R67 = 0603WAF1003T5E: 电阻类型:厚膜电阻;阻值:100kΩ;精度:±1%;功率:100mW;最大工作电压:75V;温度系数:±100ppm/℃;; LCSC Part Name: 100kΩ ±1% 100mW 厚膜电阻; Supplier Part: C25803; Manufacturer: UNI-ROYAL(厚声); Supplier Footprint: 0603; JLCPCB Part Class: 基础库; Datasheet: https://atta.szlcsc.com/upload/public/pdf/source/20200306/C422600_1E6D84923E4A46A82E41ADD87F860B5C.pdf; Supplier: LCSC; Type: 厚膜电阻; Tolerance: ±1%; Power(Watts): 100mW; Overload Voltage (Max): 75V; Temperature Coefficient: ±100ppm/℃; Operating Temperature Range: -55℃~+155℃
R4 R6 R65 = FRC0603F5233TS: 电阻类型:厚膜电阻;阻值:523kΩ;精度:±1%;功率:100mW;最大工作电压:75V;温度系数:±100ppm/℃;; LCSC Part Name: 523kΩ ±1% 100mW 厚膜电阻; Supplier Part: C5126197; Manufacturer: FOJAN(富捷); Supplier Footprint: 0603; JLCPCB Part Class: 扩展库; Datasheet: https://atta.szlcsc.com/upload/public/pdf/source/20211221/925EC7D7225764EE0046F22065062C87.pdf; Supplier: LCSC; Type: 厚膜电阻; Tolerance: ±1%; Power(Watts): 100mW; Overload Voltage (Max): 75V; Temperature Coefficient: ±100ppm/℃
R14 = FRC0603F3092TS: 电阻类型:厚膜电阻;阻值:30.9kΩ;精度:±1%;功率:100mW;最大工作电压:75V;温度系数:±100ppm/℃;; LCSC Part Name: 30.9kΩ ±1% 100mW 厚膜电阻; Supplier Part: C2930090; Manufacturer: FOJAN(富捷); Supplier Footprint: 0603; JLCPCB Part Class: 扩展库; Datasheet: https://atta.szlcsc.com/upload/public/pdf/source/20211221/925EC7D7225764EE0046F22065062C87.pdf; Supplier: LCSC; Type: 厚膜电阻; Tolerance: ±1%; Power(Watts): 100mW; Overload Voltage (Max): 75V; Temperature Coefficient: ±100ppm/℃; Operating Temperature Range: -55℃~+155℃
R16 = 0603WAF2701T5E: 电阻类型:厚膜电阻;阻值:2.7kΩ;精度:±1%;功率:100mW;最大工作电压:75V;温度系数:±100ppm/℃;; LCSC Part Name: 2.7kΩ ±1% 100mW 厚膜电阻; Supplier Part: C13167; Manufacturer: UNI-ROYAL(厚声); Supplier Footprint: 0603; JLCPCB Part Class: 基础库; Datasheet: https://atta.szlcsc.com/upload/public/pdf/source/20200306/C422600_1E6D84923E4A46A82E41ADD87F860B5C.pdf; Supplier: LCSC; Type: 厚膜电阻; Tolerance: ±1%; Power(Watts): 100mW; Overload Voltage (Max): 75V; Temperature Coefficient: ±100ppm/℃; Operating Temperature Range: -55℃~+155℃
R63 R64 = FRC0603F0000TS: 电阻类型:厚膜电阻;阻值:0Ω;精度:±1%;功率:100mW;工作电压:75V;; LCSC Part Name: 0Ω ±1% 100mW 厚膜电阻; Supplier Part: C2906974; Manufacturer: FOJAN(富捷); Supplier Footprint: 0603; JLCPCB Part Class: 扩展库; Supplier: LCSC; Type: 厚膜电阻; Tolerance: ±1%; Power(Watts): 100mW; Voltage-Supply(Max): 75V; Operating Temperature: -55℃~+155℃
SW2 = SS-12D10L5R: 拨动开关,立式直脚两档,插件,单排耐高温盐雾24小时,13x6.8x6.4平形红柄5mm; Supplier Part: C2884746; Manufacturer: XKB Connection(中国星坤); Supplier Footprint: 插件; JLCPCB Part Class: 扩展库; Datasheet: https://atta.szlcsc.com/upload/public/pdf/source/20240429/35867046E5074F55CDC419BEC7FAADDE.pdf; Supplier: LCSC
U1 = XT60-M.: 类别:-;类型1:-;; LCSC Part Name: AMASS(艾迈斯) XT60模型插头 3.5mm镀金香蕉头公头（电调端）XT60-M; Supplier Part: C98733; Manufacturer: AMASS(艾迈斯); JLCPCB Part Class: 扩展库; Datasheet: https://item.szlcsc.com/datasheet/XT60-M./99943.html; Supplier: LCSC; Type: 香蕉头; Colour: 黄色; InterfaceType: 公头; specifications: 3.5mm
U12 U14 U29 = TPS82130SILR: TPS82130 TPS82130 具有集成电感的 3A 17V 降压转换器; Supplier Part: C473914; Manufacturer: TI(德州仪器); Supplier Footprint: USIP-8; JLCPCB Part Class: 扩展库; Datasheet: https://www.ti.com/cn/lit/gpn/tps82130; Supplier: LCSC
U19 = TPS7A8001DRBR: 输出类型:可调;最大输入电压:6.5V;输出电压:800mV~6V;输出电流:1A;电源纹波抑制比(PSRR):63dB;输出极性:正极;; LCSC Part Name: 具有低 IQ 和使能功能的 1A、高 PSRR、超低压降稳压器; Supplier Part: C105265; Manufacturer: TI(德州仪器); Supplier Footprint: VSON-8-EP(3x3); JLCPCB Part Class: 扩展库; Datasheet: https://www.ti.com/cn/lit/gpn/tps7a80; Supplier: LCSC; Output Type: 可调; Maximum Input Voltage: 6.5V; Output Voltage: 800mV~6V; Output Current: 1A; Power Supply Rejection Ratio (PSRR): 63dB; Dropout Voltage: 500mV@(1A); Feature: 防静电保护；软启动；浪涌保护；低ESR；热保护(TSD)；欠压闭锁；过流保护(OCP)；带使能; Output Polarity: 正极; Number of Outputs: 1
U21 = SY6280AAC: Supplier Part: C9900003867; Supplier Footprint: SOT-23-5; JLCPCB Part Class: 扩展库; Supplier: LCSC
U27 U28 = KF301-5.0-2P: 结构:1x2P;间距:5mm;颜色:蓝色;安装方式:直插;额定电流:17A;额定电压:250V;排数:1;线规 - AWG:14~22;线规 - 平方毫米:1.5;每排PIN数:2;工作温度范围:-30℃~+120℃;; LCSC Part Name: 5mm 1x2P 排数:1 每排P数:2 直插; Supplier Part: C474881; Manufacturer: KEFA(科发); Supplier Footprint: 插件,P=5mm; JLCPCB Part Class: 扩展库; Datasheet: https://atta.szlcsc.com/upload/public/pdf/source/20230317/03A5B5FC229D6F9225E8F51DA1A4E80A.pdf; Supplier: LCSC; Structure: 1x2P; Pitch: 5mm; Color: 蓝色; Mounting Style: 直插; Current Rating (Max): 17A; Voltage Rating (Max): 250V; Number of Pins: 2P; Number of Rows: 1; Wire Gauge - AWG: 14~22; Wire Gauge - mm2: 1.5; Number of PINs Per Row: 2; Operating Temperature Range: -30℃~+120℃

## Nets
GND: C20.1 CN1.7 CN1.8 CN2.2 H1.2 H3.3 H3.4 H4.3 H4.4 H5.6 H6.6 H7.6 H8.6 J1.2 P3.2 R53.2 R63.1 R64.1 U8.2 U9.2 U10.2 U11.2 U23.2(C) U24.2(C) U25.5 U25.6 U26.1(GND) U26.2(GND)
PGND: C1.1 C3.2 C5.1 C6.2 C16.1 C17.1 C19.1 C21.2 C22.2 C23.1 C24.1 C25.1 C26.2 C28.2 C30.2 C32.2 C33.2 C34.1 C35.1 C36.1 C37.2 C38.2 C39.1 C40.2 C41.1 H2.1 Q10.2(E) R1.1 R3.2 R8.2 R15.1 R18.1 R19.2 R63.2 R64.2 R67.2 U1.1(-) U12.3(GND) U12.9(EP) U14.3(GND) U14.9(EP) U15.2(C) U19.4(GND) U19.9(EP) U20.2(C) U21.2(GND) U22.2(C) U27.1 U28.1 U29.3(GND) U29.9(EP)
VCC3V3: C17.2 C26.1 H5.5 H6.5 H7.5 H8.5 J1.4 P3.1 R14.2 R16.2 R20.1 R27.2 R28.2 R29.2 R30.2 R42.2 R43.2 U19.1(OUT) U19.2(OUT)
VCC5V: C21.1 C28.1 C30.1 C32.1 R2.1 R4.1 U12.4(VOUT) U12.5(VOUT) U19.7(IN) U19.8(IN) U21.5(IN) U26.5(5V) U26.6(5V)
VCC5V_EXT: C19.2 CN1.9 H1.1 R17.2 U21.1(OUT) U25.7
VCC_SERVO: C22.1 C33.1 H2.2 R6.1 R7.1 R9.1 U14.4(VOUT) U14.5(VOUT)
VCCBAT: C1.2 C5.2 C23.2 C24.2 C25.2 C34.2 C35.2 C36.2 C39.2 C41.2 Q1.2(D) R51.1 U12.1(EN) U12.2(VIN) U14.1(EN) U14.2(VIN) U27.2 U28.2 U29.2(VIN)
VCCCAM: C38.1 C40.1 CN2.1 R65.1 R66.1 U29.4(VOUT) U29.5(VOUT)
B3: CN1.6 U26.38(B3)
B4: CN1.10 U26.37(B4)
B5: J1.12 U26.36(B5)
B18: CN1.3 U26.23(B18)
B19: CN1.4 U26.22(B19)
B20: CN1.5 U26.21(B20)
B21: CN1.1 U26.20(B21)
B23: U26.18(B23)
B24: U26.17(B24)
B25: U26.16(B25)
B26: U26.15(B26)
B27: C20.2 R51.2 R53.1 U26.14(B27)
B28: J1.6 U26.13(B28)
B29: J1.14 U26.12(B29)
B30: J1.8 U26.11(B30)
B31: J1.10 U26.10(B31)
C0: H8.4 U26.78(C0)
C1: H8.3 U26.77(C1)
C2: H7.4 U26.76(C2)
C3: H7.3 U26.75(C3)
C5: U25.4 U26.73(C5)
C6: U25.1 U26.72(C6)
C7: U25.3 U26.71(C7)
C8: R47.2 U26.70(C8)
C9: R48.2 U26.69(C9)
C10: P3.3 U26.68(C10)
C11: P3.6 U26.67(C11)
C12: P3.4 U26.66(C12)
C13: P3.5 U26.65(C13)
C14: R49.2 U26.64(C14)
C15: R50.2 U26.63(C15)
C20: R54.2 U26.60(C20)
C21: J1.16 U26.59(C21)
C28: R56.2 U26.52(C28)
C29: R55.1 U26.51(C29)
C30: R58.2 U26.50(C30)
C31: R57.1 U26.49(C31)
CR: U19.5(EN) U21.4(EN) U26.9(CR) U29.1(EN)
D0: H1.3 U26.48(D0)
D1: H1.4 U26.47(D1)
D2: H1.5 U26.46(D2)
D3: H1.6 U26.45(D3)
D4: R60.2 U26.44(D4)
D5: R59.1 U26.43(D5)
D6: R62.2 U26.42(D6)
D7: R61.1 U26.41(D7)
D9: R13.2 R19.1 U26.39(D9)
D13: H6.4 U26.90(D13)
D14: H6.3 U26.89(D14)
D15: H5.4 U26.88(D15)
D16: H5.3 U26.87(D16)
D17: R24.2 U26.86(D17)
D18: R46.2 U26.85(D18)
D20: CN2.4 U26.83(D20)
D21: CN2.3 U26.82(D21)
$1N349: D1.2(A) R1.2 SW2.3
$1N497: Q1.1(G) SW2.2
$1N673: BT2.1 D1.1(K) Q1.3(S) SW2.1
$1N1324: C3.1 U12.8(SS/TR)
$1N1326: R3.1 R4.2 U12.6(FB)
$1N1327: R2.2 U12.7(PG)
$1N1721: C6.1 U14.8(SS/TR)
$1N1723: R6.2 R8.1 U14.6(FB)
$1N1724: R7.2 U14.7(PG)
$1N1725: R9.2 U15.1(A)
$1N3027: C16.2 U19.6(NR)
$1N3028: R14.1 R15.2 U19.3(FB/SNS)
$1N3033: R16.1 U20.1(A)
$1N5176: R17.1 U22.1(A)
$1N5235: R18.2 U21.3(ISET)
$1N10748: BT2.2 U1.2(+)
$1N12967: C37.1 U29.8(SS/TR)
$1N12969: R65.2 R67.1 U29.6(FB)
$1N12970: R66.2 U29.7(PG)
$2N884: BUZZER1.1(+) R20.2
$2N885: BUZZER1.2(-) Q10.3(C)
$2N886: Q10.1(B) R13.1
$2N1412: R24.1 R42.1 SW3.2
$2N1413: R43.1 R46.1 SW3.1
$2N1500: SW3.4 U24.1(A)
$2N1505: SW3.3 U23.1(A)
$2N2045: R27.1 R47.1 U8.1
$2N2046: R28.1 R48.1 U9.1
$2N2047: R29.1 R49.1 U10.1
$2N2048: R30.1 R50.1 U11.1
$2N3059: H2.3 R54.1
$2N3392: H3.1 R57.2
$2N3397: H3.5 R58.1
$2N3403: H3.6 R56.1
$2N3409: H3.2 R55.2
$2N3702: H4.1 R61.2
$2N3705: H4.5 R62.1
$2N3708: H4.6 R60.1
$2N3711: H4.2 R59.2

Not connected (* = marked no-connect by the designer): CN1 2*; H5 1* 2*; H6 1* 2*; H7 1* 2*; H8 1* 2*; J1 1* 3* 5* 7* 9* 11* 13* 15*; P3 7* 8*; U25 2* 8*; U26 3(3V3)* 4(3V3)* 7(OF)* 8(WU)* 19(B22)* 24(B17)* 25(B16)* 26(B15)* 27(B14)* 28(B13)* 29(B12)* 30(B11)* 31(B10)* 32(B9)* 33(B8)* 34(B7)* 35(B6)* 40(D8)* 53(C27)* 54(C26)* 55(C25)* 56(C24)* 57(C23)* 58(C22)* 61(C19)* 62(C18)* 74(C4)* 79(D24)* 80(D23)* 81(D22)* 84(D19)*

## Notes on the sheets
sheet 1
- 电源接口
- 5V上电时序控制开关
- 驱动板电源
- 单点接地（功率地和数字地）
- 5V电源（第二个输入10uF电容仅在输入为8V时启用）
- 摄像头电源
- 舵机电源（固定5V输出，第二个输入10uF电容仅在输入为8V时启用）
- 3V3电源
- 两个DCDC（BUCK）不管是12V还是8V输入，都能输出5V
sheet 2
- 屏幕
- 姿态传感器
- ToF传感器
- 无线串口
- 驱动信号1
- 电压检测
- openart
- 舵机
- 蜂鸣器
- 使用反向线
- 驱动信号2
- SPI-WIFI
- 拨码开关
- 轻触开关
- 编码器
